# EAGLE design blnkbrd (EAGLE 9.6.2)
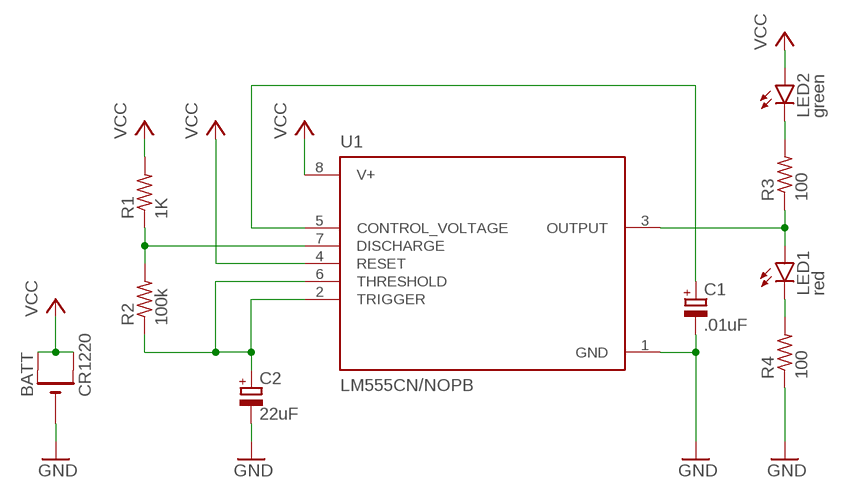
[diagram p0: schematic, sheet 1]

## Parts
BATT  CR1220  CR1220SMT  [CR1220-SMD]
C1  .01uF  CPOL-EUE2,5-6E  [E2,5-6E]
C2  22uF  CPOL-EUE2,5-6E  [E2,5-6E]
LED1  red  LED3MM  [LED3MM]
LED2  green  LED3MM  [LED3MM]
R1  1K  R-US_0207/10  [0207/10]
R2  100k  R-US_0207/10  [0207/10]
R3  100  R-US_0207/10  [0207/10]
R4  100  R-US_0207/10  [0207/10]
U1  LM555CN/NOPB  [DIP794W45P254L959H508Q8]

## Nets
CONN: C2.+ R2.1 U1.2(TRIGGER) U1.6(THRESHOLD)
GND: BATT.- C1.- C2.- R4.1 U1.1(GND)
N$1: LED2.K(C) R3.2
N$2: LED1.A R3.1 U1.3(OUTPUT)
N$3: LED1.K(C) R4.2
N$4: R1.1 R2.2 U1.7(DISCHARGE)
N$7: C1.+ U1.5(CONTROL_VOLTAGE)
VCC: BATT.+$1(+) BATT.+$2(+1) LED2.A R1.2 U1.4(RESET) U1.8(V+)

## Library data of the parts
BATT = adafruit:CR1220: CR1216/CR1220/CR1225 12mm 3V lithium coin cell Great for battery packup. Both SMT and THM holders. Note the THM package has the ground pads on both sides of the PCB so that the masks are the same - this reduces the cost
C1 C2 = rcl:CPOL-EU: POLARIZED CAPACITOR, European symbol; SPICEPREFIX: C
LED1 LED2 = led:LED: LED OSRAM: - CHIPLED LG R971, LG N971, LY N971, LG Q971, LY Q971, LO R971, LY R971 LH N974, LH R974 LS Q976, LO Q976, LY Q976 LO Q996 - Hyper CHIPLED LW Q18S LB Q993, LB Q99A, LB R99A - SideLED LS A670, LO A670, LY A670, LG A670, LP A670 LB A673, LV A673, LT A673, LW A673 LH A674 LY A675 LS A676, LA A676, LO A676, LY A676, LW A676 LS A679, LY A679, LG A679 - Hyper Micro SIDELED® LS Y876, LA Y876, LO Y876, LY Y876 LT Y87S - SmartLED LW L88C, LW L88S LB L89C, LB L89S, LG L890 LS L89K, LO L89K, LY L89K LS L896, LA L896, LO L896, LY L896 - TOPLED LS T670, LO T670, LY T670, LG T670, LP T670 LSG T670, LSP T670, LSY T670, LOP T670, LYG T670 LG T671, LOG T671, LSG T671 LB T673, LV T673, LT T673, LW T673 LH T674 LS T676, LA T676, LO T676, LY T676, LB T676, LH T676, LSB T676, LW T676 LB T67C, LV T67C, LT T67C, LS T67K, LO T67K, LY T67K, LW E67C LS E67B, LA E67B, LO E67B, LY E67B, LB E67C, LV E67C, LT E67C LW T67C LS T679, LY T679, LG T679 LS T770, LO T770, LY T770, LG T770, LP T770 LB T773, LV T773, LT T773, LW T773 LH T774 LS E675, LA E675, LY E675, LS T675 LS T776, LA T776, LO T776, LY T776, LB T776 LHGB T686 LT T68C, LB T68C - Hyper Mini TOPLED® LB M676 - Mini TOPLED Santana® LG M470 LS M47K, LO M47K, LY M47K Source: http://www.osram.convergy.de LUXEON: - LUMILED® LXK2-PW12-R00, LXK2-PW12-S00, LXK2-PW14-U00, LXK2-PW14-V00 LXK2-PM12-R00, LXK2-PM12-S00, LXK2-PM14-U00 LXK2-PE12-Q00, LXK2-PE12-R00, LXK2-PE12-S00, LXK2-PE14-T00, LXK2-PE14-U00 LXK2-PB12-K00, LXK2-PB12-L00, LXK2-PB12-M00, LXK2-PB14-N00, LXK2-PB14-P00, LXK2-PB14-Q00 LXK2-PR12-L00, LXK2-PR12-M00, LXK2-PR14-Q00, LXK2-PR14-R00 LXK2-PD12-Q00, LXK2-PD12-R00, LXK2-PD12-S00 LXK2-PH12-R00, LXK2-PH12-S00 LXK2-PL12-P00, LXK2-PL12-Q00, LXK2-PL12-R00 Source: www.luxeon.com KINGBRIGHT: KA-3528ASYC Source: www.kingbright.com
R1-R4 = rcl:R-US_: RESISTOR, American symbol; SPICEPREFIX: R
U1 = LM555CN_NOPB:LM555CN/NOPB: Check prices <https://pricing.snapeda.com/parts/LM555CN/NOPB/Texas%20Instruments/view-part?ref=eda>; AVAILABILITY: Good; DESCRIPTION: Highly Stable 555 Timer 8-PDIP 0 to 70; MF: Texas Instruments; MP: LM555CN/NOPB; PACKAGE: PDIP-8 Texas; PRICE: None; PURCHASE-URL: https://pricing.snapeda.com/search/part/LM555CN/NOPB/?ref=eda

## Net classes
0 default: width 0.305 mm, drill 0.508 mm, clearance 0.254 mm

## Board
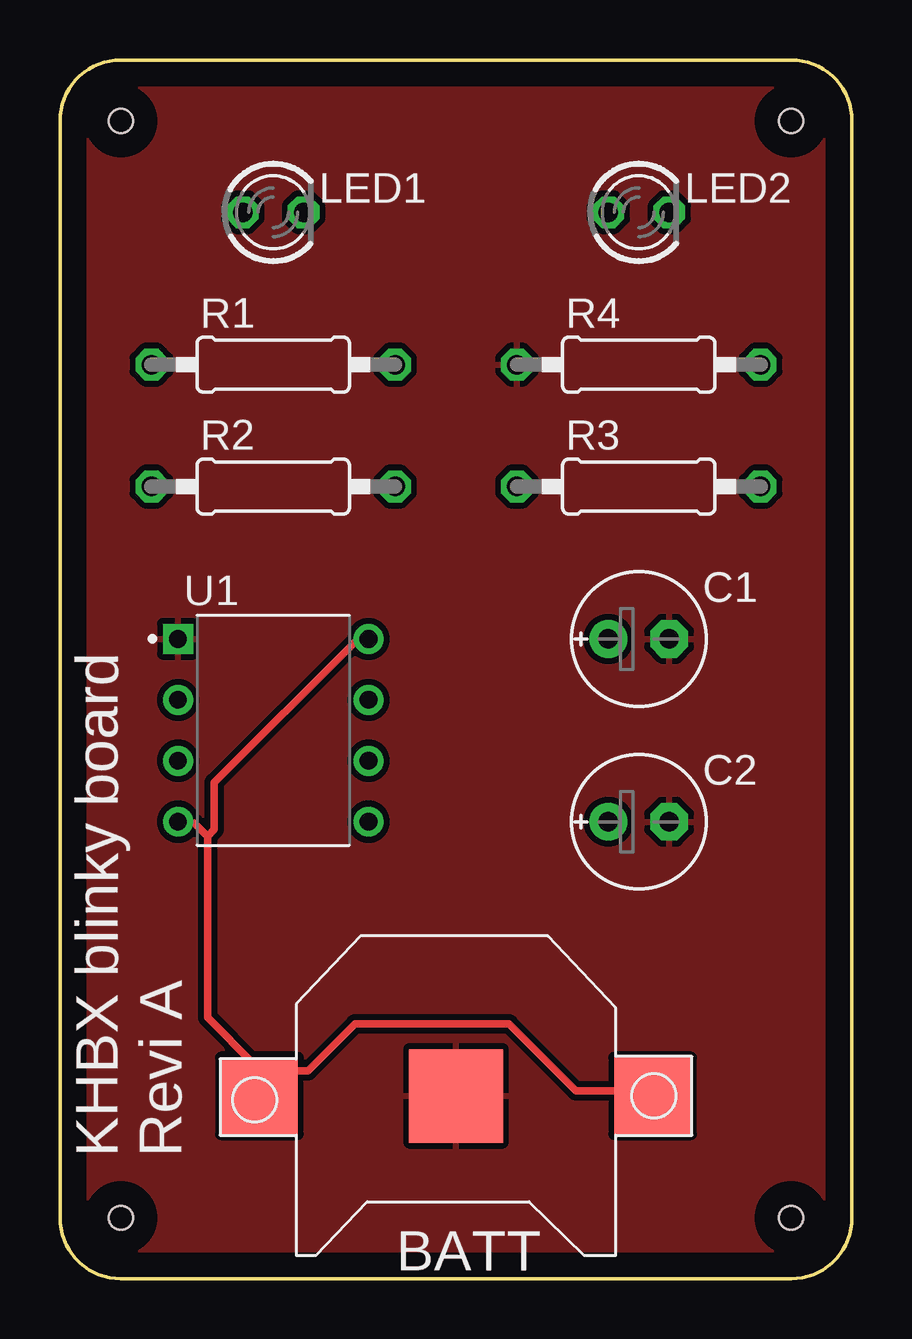
[diagram p1: board, top side]
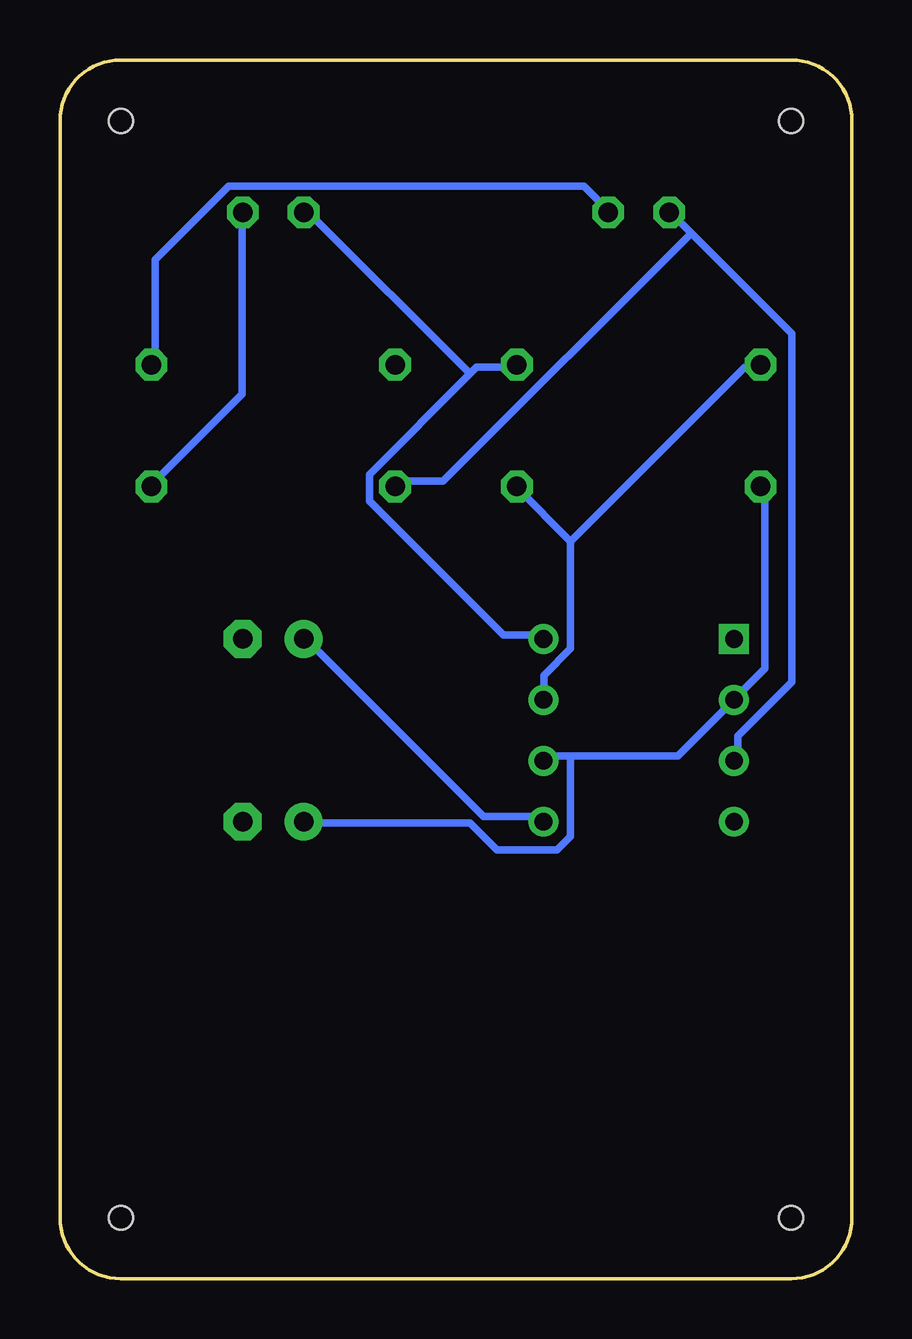
[diagram p2: board, bottom side, seen from below]

Size 33.02 x 50.8 mm. Coordinates in mm from the lower left corner, seen from the top.
Outline: 2.54,0 arc-90 0,2.54 0,48.26 arc-90 2.54,50.8 30.48,50.8 arc-90 33.02,48.26 33.02,2.54 arc-90 30.48,0 2.54,0
Copper layers (1*16): Top 0.035mm / dielectric 1.5mm / Bottom 0.035mm
Design rules "default": minimum track width 6mil, minimum drill 0.35mm, track to track 6mil, track to pad 6mil, pad to pad 6mil, via to via 6mil, smd to smd 6mil, copper to edge 40mil, drill to drill 6mil, minimum pad ring 10mil, minimum via ring 8mil, stop-mask expansion 4mil, vias tented up to drill 0mil, thermal gap 10mil
Holes 1 mm at 30.48,2.54 2.54,2.54 2.54,48.26 30.48,48.26

### Footprints (pad centres in the part's own frame; a part is rotated, then mirrored left to right if it is on the bottom)
CR1220-SMD = smd 3.2 x 3.2: +$1 -8.2,0; +$2 8.2,0 | smd 3.9 x 3.9: - 0,0
E2,5-6E = drill 0.813 pad 1.575: + -1.27,0 | drill 0.813 pad 1.575 octagon: - 1.27,0
LED3MM = drill 0.813 octagon: A -1.27,0; K 1.27,0
0207/10 = drill 0.813 octagon: 1 -5.08,0; 2 5.08,0
DIP794W45P254L959H508Q8 = drill 0.74 pad 1.13 square: 1 -3.97,3.81 | drill 0.74 pad 1.13: 2 -3.97,1.27; 3 -3.97,-1.27; 4 -3.97,-3.81; 5 3.97,-3.81; 6 3.97,-1.27; 7 3.97,1.27; 8 3.97,3.81

### Placement (x,y rotation side)
BATT  16.51,7.62 180 top
C1  24.13,26.67 0 top
C2  24.13,19.05 0 top
LED1  8.89,44.45 0 top
LED2  24.13,44.45 0 top
R1  8.89,38.1 0 top
R2  8.89,33.02 0 top
R3  24.13,33.02 0 top
R4  24.13,38.1 0 top
U1  8.89,22.86 0 top

### Tracks (layer width: path | path; a pad name or v marks a point on that pad's centre or on a via)
CONN
  Bottom 0.305: 11.73,21.79 7.26,21.79 5.03,24.03 U1.2 4.75,24.31 3.63,25.43 3.63,32.97 R2.1 | 11.73,21.79 12.85,21.79 U1.6 | 11.73,21.79 11.73,18.44 12.29,17.88 14.81,17.88 15.93,19 22.63,19 C2.+
GND
  pour Top: -1.27,52.07 -1.27,-1.27 34.29,-1.27 34.29,52.07
N$1
  Bottom 0.305: LED2.K 25.43,44.42 25.43,36.88 29.06,33.25 R3.2
N$2
  Bottom 0.305: 6.71,43.59 7.54,44.42 LED1.A | 6.71,43.59 2.52,39.4 2.52,24.87 4.75,22.63 4.75,21.79 U1.3 | 6.71,43.59 17.04,33.25 19,33.25 R3.1
N$3
  Bottom 0.305: R4.2 29.06,38.28 29.06,42.47 25.98,45.54 11.18,45.54 10.34,44.7 LED1.K
N$4
  Bottom 0.305: 11.73,30.73 11.73,26.26 12.85,25.15 12.85,24.31 U1.7 | 11.73,30.73 13.97,32.97 R2.2 | 11.73,30.73 4.47,38 3.91,38 R1.1
N$7
  Bottom 0.305: U1.5 13.13,19.28 15.37,19.28 22.63,26.54 C1.+
VCC
  Top 0.305: 6.15,18.44 5.59,19 5.03,19 U1.4 | 6.15,18.44 6.15,10.9 8.1,8.94 8.1,8.66 | 8.1,8.66 8.1,7.82 BATT.+$2 8.1,8.66 | 8.1,8.66 10.34,8.66 12.29,10.62 18.72,10.62 21.51,7.82 24.59,7.82 BATT.+$1 | 6.15,18.44 6.43,18.72 6.43,20.68 12.29,26.54 12.85,26.54 U1.8
  Bottom 0.305: 15.93,37.72 15.65,38 13.97,38 R1.2 | 15.93,37.72 20.12,33.53 20.12,32.41 14.53,26.82 13.13,26.82 U1.8 | 15.93,37.72 22.63,44.42 LED2.A

### Text on the board
tNames: KHBX blinky board / Revi A